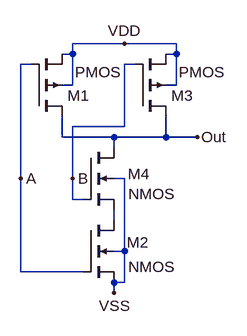
[diagram p0: schematic NAND.asc]
NAND.asc, the LTspice schematic file:
Version 4
SHEET 1 880 680
WIRE 352 16 272 16
WIRE 432 16 352 16
WIRE 272 32 272 16
WIRE 272 32 256 32
WIRE 432 32 432 16
WIRE 432 32 416 32
WIRE 208 48 192 48
WIRE 368 48 352 48
WIRE 272 80 272 32
WIRE 272 80 256 80
WIRE 432 80 432 32
WIRE 432 80 416 80
WIRE 352 144 352 48
WIRE 352 144 272 144
WIRE 256 160 256 128
WIRE 336 160 256 160
WIRE 416 160 416 128
WIRE 416 160 336 160
WIRE 464 160 416 160
WIRE 336 176 336 160
WIRE 192 224 192 48
WIRE 272 224 272 144
WIRE 352 224 336 224
WIRE 272 256 272 224
WIRE 288 256 272 256
WIRE 336 288 336 272
WIRE 352 336 352 224
WIRE 352 336 336 336
WIRE 192 368 192 224
WIRE 288 368 192 368
WIRE 352 384 352 336
WIRE 352 384 336 384
WIRE 336 400 336 384
FLAG 336 400 VSS
FLAG 352 16 VDD
FLAG 464 160 Out
FLAG 192 224 A
FLAG 272 224 B
SYMBOL pmos4 208 128 M180
WINDOW 3 68 68 Left 2
SYMATTR InstName M1
SYMATTR Value2 l=500n w=2u
SYMBOL nmos4 288 288 R0
WINDOW 3 70 72 Left 2
WINDOW 0 68 34 Left 2
SYMATTR InstName M2
SYMBOL pmos4 368 128 M180
WINDOW 3 68 68 Left 2
SYMATTR InstName M3
SYMATTR Value2 l=500n w=2u
SYMBOL nmos4 288 176 R0
WINDOW 3 70 72 Left 2
WINDOW 0 69 41 Left 2
SYMATTR InstName M4

The netlist it stands for:
* NAND.asc
M1 Out A VDD VDD PMOS l=500n w=2u
M2 N001 A VSS VSS NMOS
M3 Out B VDD VDD PMOS l=500n w=2u
M4 Out B N001 VSS NMOS
.model NMOS NMOS
.model PMOS PMOS
.lib standard.mos
.backanno
.end